# Altium schematic sheet Sheet1.SCHDOC
size 1188 x 840 mm; SheetNumber: 1; SheetTotal: 1; DocumentName: Sheet1.SCHDOC
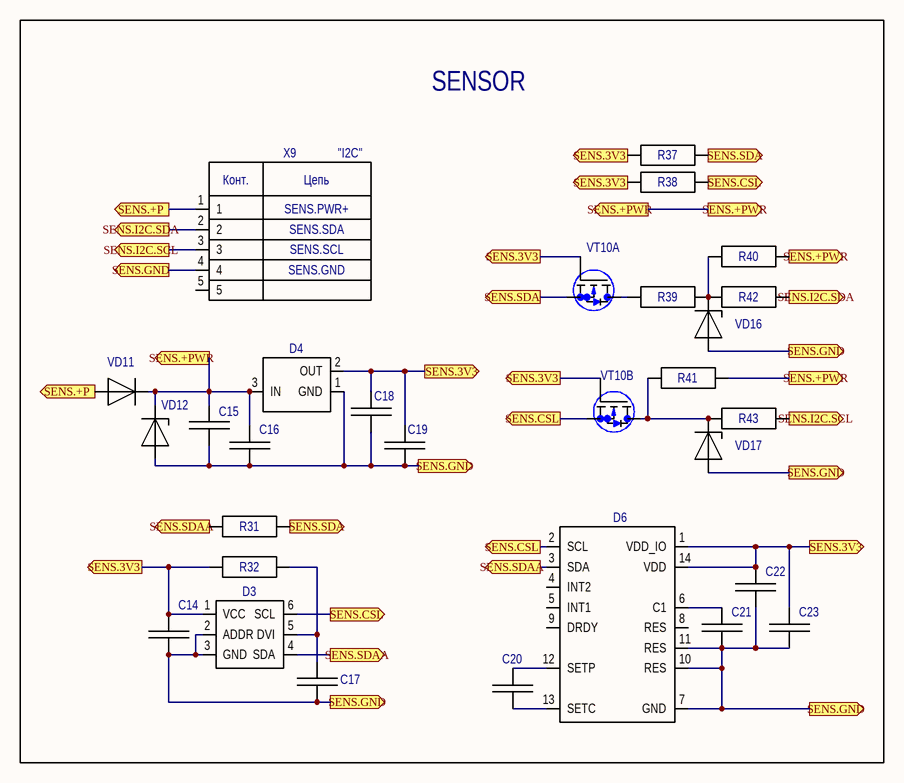
[diagram p0: Sheet1.SCHDOC]

## Parts
C14  C0805THRU  [RC0805_THRU]  (value not drawn)
C15  CC1210  [1210T]  (value not drawn)
C16  C0805THRU  (value not drawn)
C17  C0805THRU  [RC0805_THRU]  (value not drawn)
C18  C0805THRU  [RC0805_THRU]  (value not drawn)
C19  C0805THRU  (value not drawn)
C20  C0805THRU  [RC0805_THRU]  (value not drawn)
C21  C0805THRU  [RC0805_THRU]  (value not drawn)
C22  C0805THRU  [RC0805_THRU]  (value not drawn)
C23  C0805THRU  [RC0805_THRU]  (value not drawn)
D3  BH1750FVI  (value not drawn)
D4  LD1117  [SOT223]  (value not drawn)
D6  LSM303  (value not drawn)
R31  R0805THRU  [RC0805_THRU]  (value not drawn)
R32  R0805THRU  [RC0805_THRU]  (value not drawn)
R37  R0805THRU  [RC0805_THRU]  (value not drawn)
R38  R0805THRU  [RC0805_THRU]  (value not drawn)
R39  R1206  [1206T]  (value not drawn)
R40  R0805THRU  [RC0805_THRU]  (value not drawn)
R41  R0805THRU  [RC0805_THRU]  (value not drawn)
R42  R0805THRU  [RC0805_THRU]  (value not drawn)
R43  R0805THRU  [RC0805_THRU]  (value not drawn)
VD11  LL4148  (value not drawn)
VD12  BZV55  [SMD4148]  (value not drawn)
VD16  BZV55  [SMD4148]  (value not drawn)
VD17  BZV55  [SMD4148]  (value not drawn)
VT10  NTZD3155C  [SOT-363]  (value not drawn)  (parts A,B of 2)
X9  tit: "I2C"  a1: SENS.PWR+  a2: SENS.SDA  a3: SENS.SCL  a4: SENS.GND  [15EDGRC-3.5-05P]  (hidden comment: 15EDGRC-3.5-05P)

## Blocks framed on the sheet
SENSOR: C14-C23 D3 D4 D6 R31 R32 R37-R43 VD11 VD12 VD16 VD17 VT10 X9

## Ports
SENS.3V3 (out), SENS.+P (out), SENS.+PWR (out), SENS.CSL (out), SENS.GND (out), SENS.I2C.SCL (out), SENS.I2C.SDA (out), SENS.SDA (out), SENS.SDAA (out)

## Nets
SENS.3V3: C14.2 C18.1 C19.1 C22.2 C23.2 D3.1(VCC) D4.2(OUT) D6.1(VDD_IO) D6.14(VDD) R32.1 R37.1 R38.1 VT10.2 VT10.5 ; port SENS.3V3
SENS.+P: VD11.1 X9.1 ; port SENS.+P
SENS.+PWR: C15.2 C16.1 D4.3(IN) R40.2 R41.2 VD11.2 VD12.2 ; port SENS.+PWR
SENS.CSL: D3.6(SCL) D6.2(SCL) R38.2 VT10.4 ; port SENS.CSL
SENS.GND: C14.1 C15.1 C16.2 C17.1 C18.2 C19.2 C21.1 C22.1 C23.1 D3.2(ADDR) D3.3(GND) D4.1(GND) D6.7(GND) D6.10(RES) D6.11(RES) VD12.1 VD16.1 VD17.1 X9.4 ; port SENS.GND
SENS.I2C.SCL: R43.2 X9.3 ; port SENS.I2C.SCL
SENS.I2C.SDA: R42.2 X9.2 ; port SENS.I2C.SDA
SENS.SDA: R31.2 R37.2 VT10.1 ; port SENS.SDA
SENS.SDAA: D3.4(SDA) D6.3(SDA) R31.1 ; port SENS.SDAA
NetC17_2: C17.2 D3.5(DVI) R32.2
NetC20_1: C20.1 D6.13(SETC)
NetC20_2: C20.2 D6.12(SETP)
NetC21_2: C21.2 D6.6(C1)
NetR39_1: R39.1 VT10.6
NetR39_2: R39.2 R40.1 R42.1 VD16.2
NetR41_1: R41.1 R43.1 VD17.2 VT10.3

Not connected (* = marked no-connect by the designer): D6 4(INT2) 5(INT1) 8(RES) 9(DRDY); X9 5

## Notes on the sheet
- {Децим_номер_инв}
- Перв. примен.
- {Перв_примен}
- Справ. №
- Подп. и дата
- Инв. № дубл.
- Взам. инв. №
- {Децим_номер}
- Изм.
- Разраб.
- Лист
- № докум.
- Подп.
- Дата
- {Название(сокр)}
- {Название}
- {Литера}
- Лит.
- Масса
- Масштаб
- Пров.
- Т. контр.
- {Пров}
- {Разраб}
- {Тконтр}
- Схема электрическая принципиальная
- Листов
- Инв. № подл.
- Утв.
- Н. контр.
- {Нконтр}
- {Утв}
- Формат А4
- (in symbol 15EDGRC-3.5-05P) Конт.; Цепь

## Library data of the parts
C14 C17 C23 = C0805THRU: Value: GRM21BR71H104KA01; Title: Конденсатор; Exec: C; Price: 000000,55
C15 = CC1210: Value: GRM32DR71E106KA12L; Title: Конденсатор; Exec: {Exec}; Price: 000003,00
C16 C19 = C0805THRU_VARIANT_1: Value: GRM21BR71H104KA01; Title: Конденсатор; Price: 000000,55
C18 = C0805THRU_VARIANT_2: Value: GRM219R61E106KA12D; Title: Конденсатор; Price: 000002,00
C20 = C0805THRU: Value: GRM21BR71H224KA01; Title: Конденсатор; Exec: {Exec}; Price: 000000,55
C21 = C0805THRU: Value: GRM219R61E475KA12D; Title: Конденсатор; Exec: {Exec}; Price: 000000,55
C22 = C0805THRU: Value: GRM219R61E106KA12D; Title: Конденсатор; Exec: C; Price: 000002,00
D3 = BH1750FVI: Exec: {Exec}; Value: BH1750FVI; Price: 000045,00
D4 = LD1117: Value: LD1117S33TR; Exec: {Exec}; Price: 000005,00
D6 = LSM303: Value: LSM303DLHC; Exec: {Exec}; Price: 000095,00
R31 = R0805THRU: Value: 0805WAJ0000T10; Note: ROYALOHM; Exec: {Exec}; Price: 000000,05
R32 R40 R41 = R0805THRU: Value: 0805WAJ0103T10; Note: ROYALOHM; Exec: {Exec}; Price: 000000,05
R37 R38 = R0805THRU: Value: 0805WAJ0222T10; Note: ROYALOHM; Exec: {Exec}; Price: 000000,05
R39 = R1206: Value: 1206WAJ0000T10; Note: ROYALOHM; Exec: {Exec}; Price: 000000,05
R42 R43 = R0805THRU: Value: 0805WAJ0100T10; Note: ROYALOHM; Exec: {Exec}; Price: 000000,05
VD11 = LL4148: Value: LL4148-GS08; Exec: {Exec}; Price: 000000,40
VD12 = BZV55: Value: BZV55-C18.115; Title: Стабилитрон; Exec: {Exec}; Price: 000001,00
VD16 VD17 = BZV55: Value: BZV55-C18.115; Title: Стабилитрон; Note: {Note}; Exec: {Exec}; Price: 000001,00
VT10 = NTZD3155C: Value: NTJD5121NT1G; Price: 000005,00
X9 = 15EDGRC-3.5-05P: Value: 15EDGK-3.5-04P-14-00AH; Title: Колодка; Exec: {Exec}; Price: 000012,00